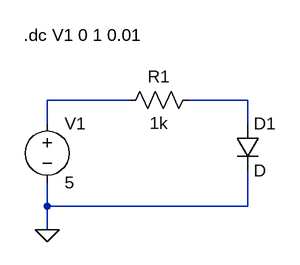
[diagram p0: schematic Diode.asc]
Diode.asc, the LTspice schematic file:
Version 4.1
SHEET 1 880 680
WIRE 112 80 0 80
WIRE 272 80 192 80
WIRE 0 112 0 80
WIRE 272 112 272 80
WIRE 0 224 0 192
WIRE 272 224 272 176
WIRE 272 224 0 224
WIRE 0 256 0 224
FLAG 0 256 0
SYMBOL voltage 0 96 R0
SYMATTR InstName V1
SYMATTR Value 5
SYMBOL res 208 64 R90
WINDOW 0 0 56 VBottom 2
WINDOW 3 32 56 VTop 2
SYMATTR InstName R1
SYMATTR Value 1k
SYMBOL diode 256 112 R0
SYMATTR InstName D1
TEXT -32 -8 Left 2 !.dc V1 0 1 0.01

The netlist it stands for:
* Diode.asc
V1 N001 0 5
R1 N002 N001 1k
D1 N002 0 D
.model D D
.lib standard.dio
.dc V1 0 1 0.01
.backanno
.end